# EAGLE schematic Barnabas bot (EAGLE 7.6.0)
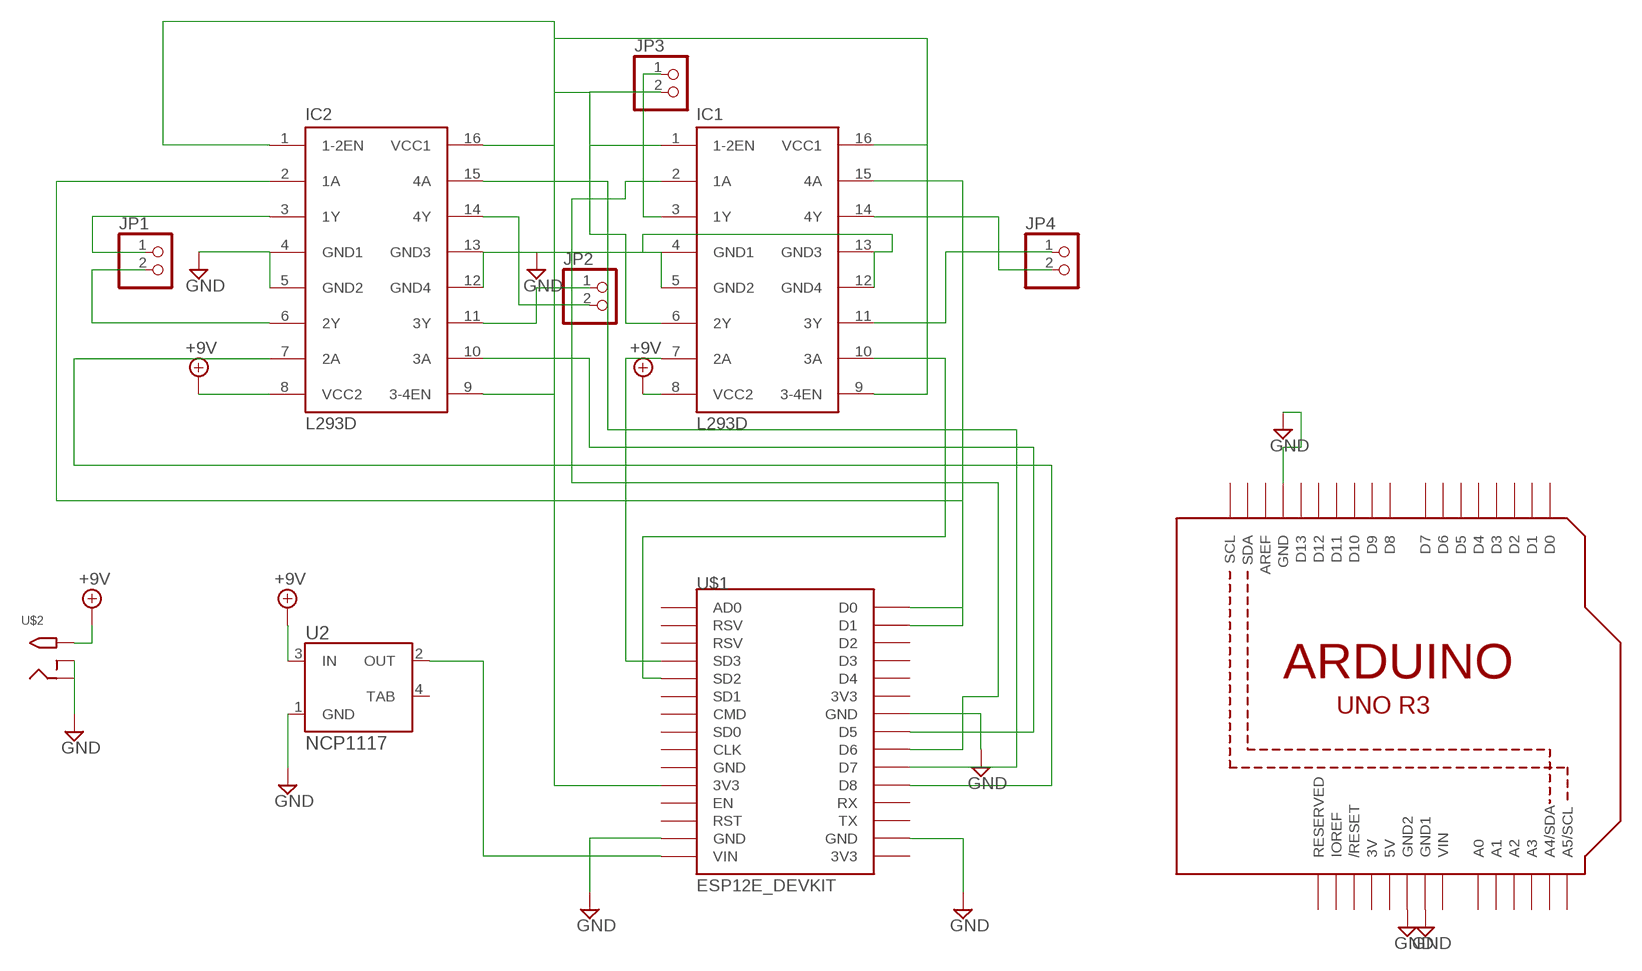
[diagram p0: schematic, sheet 1]

## Parts
IC1  L293D  [DIL16]
IC2  L293D  [DIL16]
JP1  PINHD-1X2  [1X02]
JP2  PINHD-1X2  [1X02]
JP3  PINHD-1X2  [1X02]
JP4  PINHD-1X2  [1X02]
U1  ARDUINOR3-DIMENSION  [ARDUINOR3]
U2  NCP1117  [SOT223]
U$1  ESP12E_DEVKIT  [ESP12E_DEVKIT]
U$2  2.1MMJACKTHM  [PJ-102A]

## Nets
+9V: IC1.8(VCC2) IC2.8(VCC2) U2.3(IN) U$2.TIP
GND: IC1.4(GND1) IC1.5(GND2) IC1.12(GND4) IC1.13(GND3) IC2.4(GND1) IC2.5(GND2) IC2.12(GND4) IC2.13(GND3) U1.GND U1.GND1 U1.GND2 U2.1(GND) U$1.GND@1(GND) U$1.GND@2(GND) U$1.GND@3(GND) U$2.RING_SW
N$2: IC2.7(2A) U$1.D8
N$3: IC1.1(1-2EN) IC1.9(3-4EN) IC1.16(VCC1) IC2.1(1-2EN) IC2.9(3-4EN) IC2.16(VCC1) U$1.3V3@0(3V3)
N$4: IC2.2(1A) U$1.D0
N$5: IC2.10(3A) U$1.D5
N$6: IC2.15(4A) U$1.D7
N$7: IC1.2(1A) U$1.D6
N$8: IC1.7(2A) U$1.SD3
N$9: IC1.10(3A) U$1.SD2
N$10: IC1.15(4A) U$1.D1
N$11: IC2.3(1Y) JP1.1
N$12: IC2.6(2Y) JP1.2
N$13: IC2.11(3Y) JP2.1
N$14: IC2.14(4Y) JP2.2
N$15: IC1.3(1Y) JP3.1
N$16: IC1.6(2Y) JP3.2
N$17: IC1.14(4Y) JP4.2
N$18: IC1.11(3Y) JP4.1
N$20: U2.2(OUT) U$1.VIN
Unconnected: U1.A0 U1.A1 U1.A2 U1.A3 U1.A4(A4/SDA) U1.A5(A5/SCL) U1.AREF U1.D0 U1.D1 U1.D2 U1.D3 U1.D4 U1.D5 U1.D6 U1.D7 U1.D8 U1.D9 U1.D10 U1.D11 U1.D12 U1.D13 U1.IOREF U1.RESERVED U1.RESET(/RESET) U1.SCL U1.SDA U2.4(TAB) U$1.3V3@1(3V3) U$1.3V3@2(3V3) U$1.AD0 U$1.CLK U$1.CMD U$1.D2 U$1.D3 U$1.D4 U$1.EN U$1.GND@0(GND) U$1.RST U$1.RSV@0(RSV) U$1.RSV@1(RSV) U$1.RX U$1.SD0 U$1.SD1 U$1.TX U$2.RING

## Power pins joined to a net without a drawn wire
3V: U1.3V
5V: U1.5V
VIN: U1.VIN

## Library data of the parts
IC1 IC2 = st-microelectronics:L293D: PUSH-PULL 4 CHANNEL DRIVER; MPN: L293D; OC_FARNELL: 9589619; OC_NEWARK: 56P8249
JP1-JP4 = pinhead:PINHD-1X2: PIN HEADER
U1 = adafruit:ARDUINOR3: This is a new object for the new Arduino R3 - with extra pins that you may want to use (such as IOref, and duplicated A4/A5
U2 = ELL-i-PowerIC:NCP1117
U$1 = ESP12E_DEVKIT:ESP12E_DEVKIT: ESP12E DEVKIT BOARD
U$2 = adafruit:2.1MMJACK: 2.1mm x 5.5mm THM DC jack with internal switch. Digikey part #PJ-102A, 4UCON part #05537 2.1mm x 5.5mm SMT DC jack with internal switch. Digikey part #PJ-002A-SMT, 4UCON part #03267 By microbuilder.eu & adafruit.com